# EAGLE design homegreen_node_basic v1.4.3 (EAGLE 9.6.2)
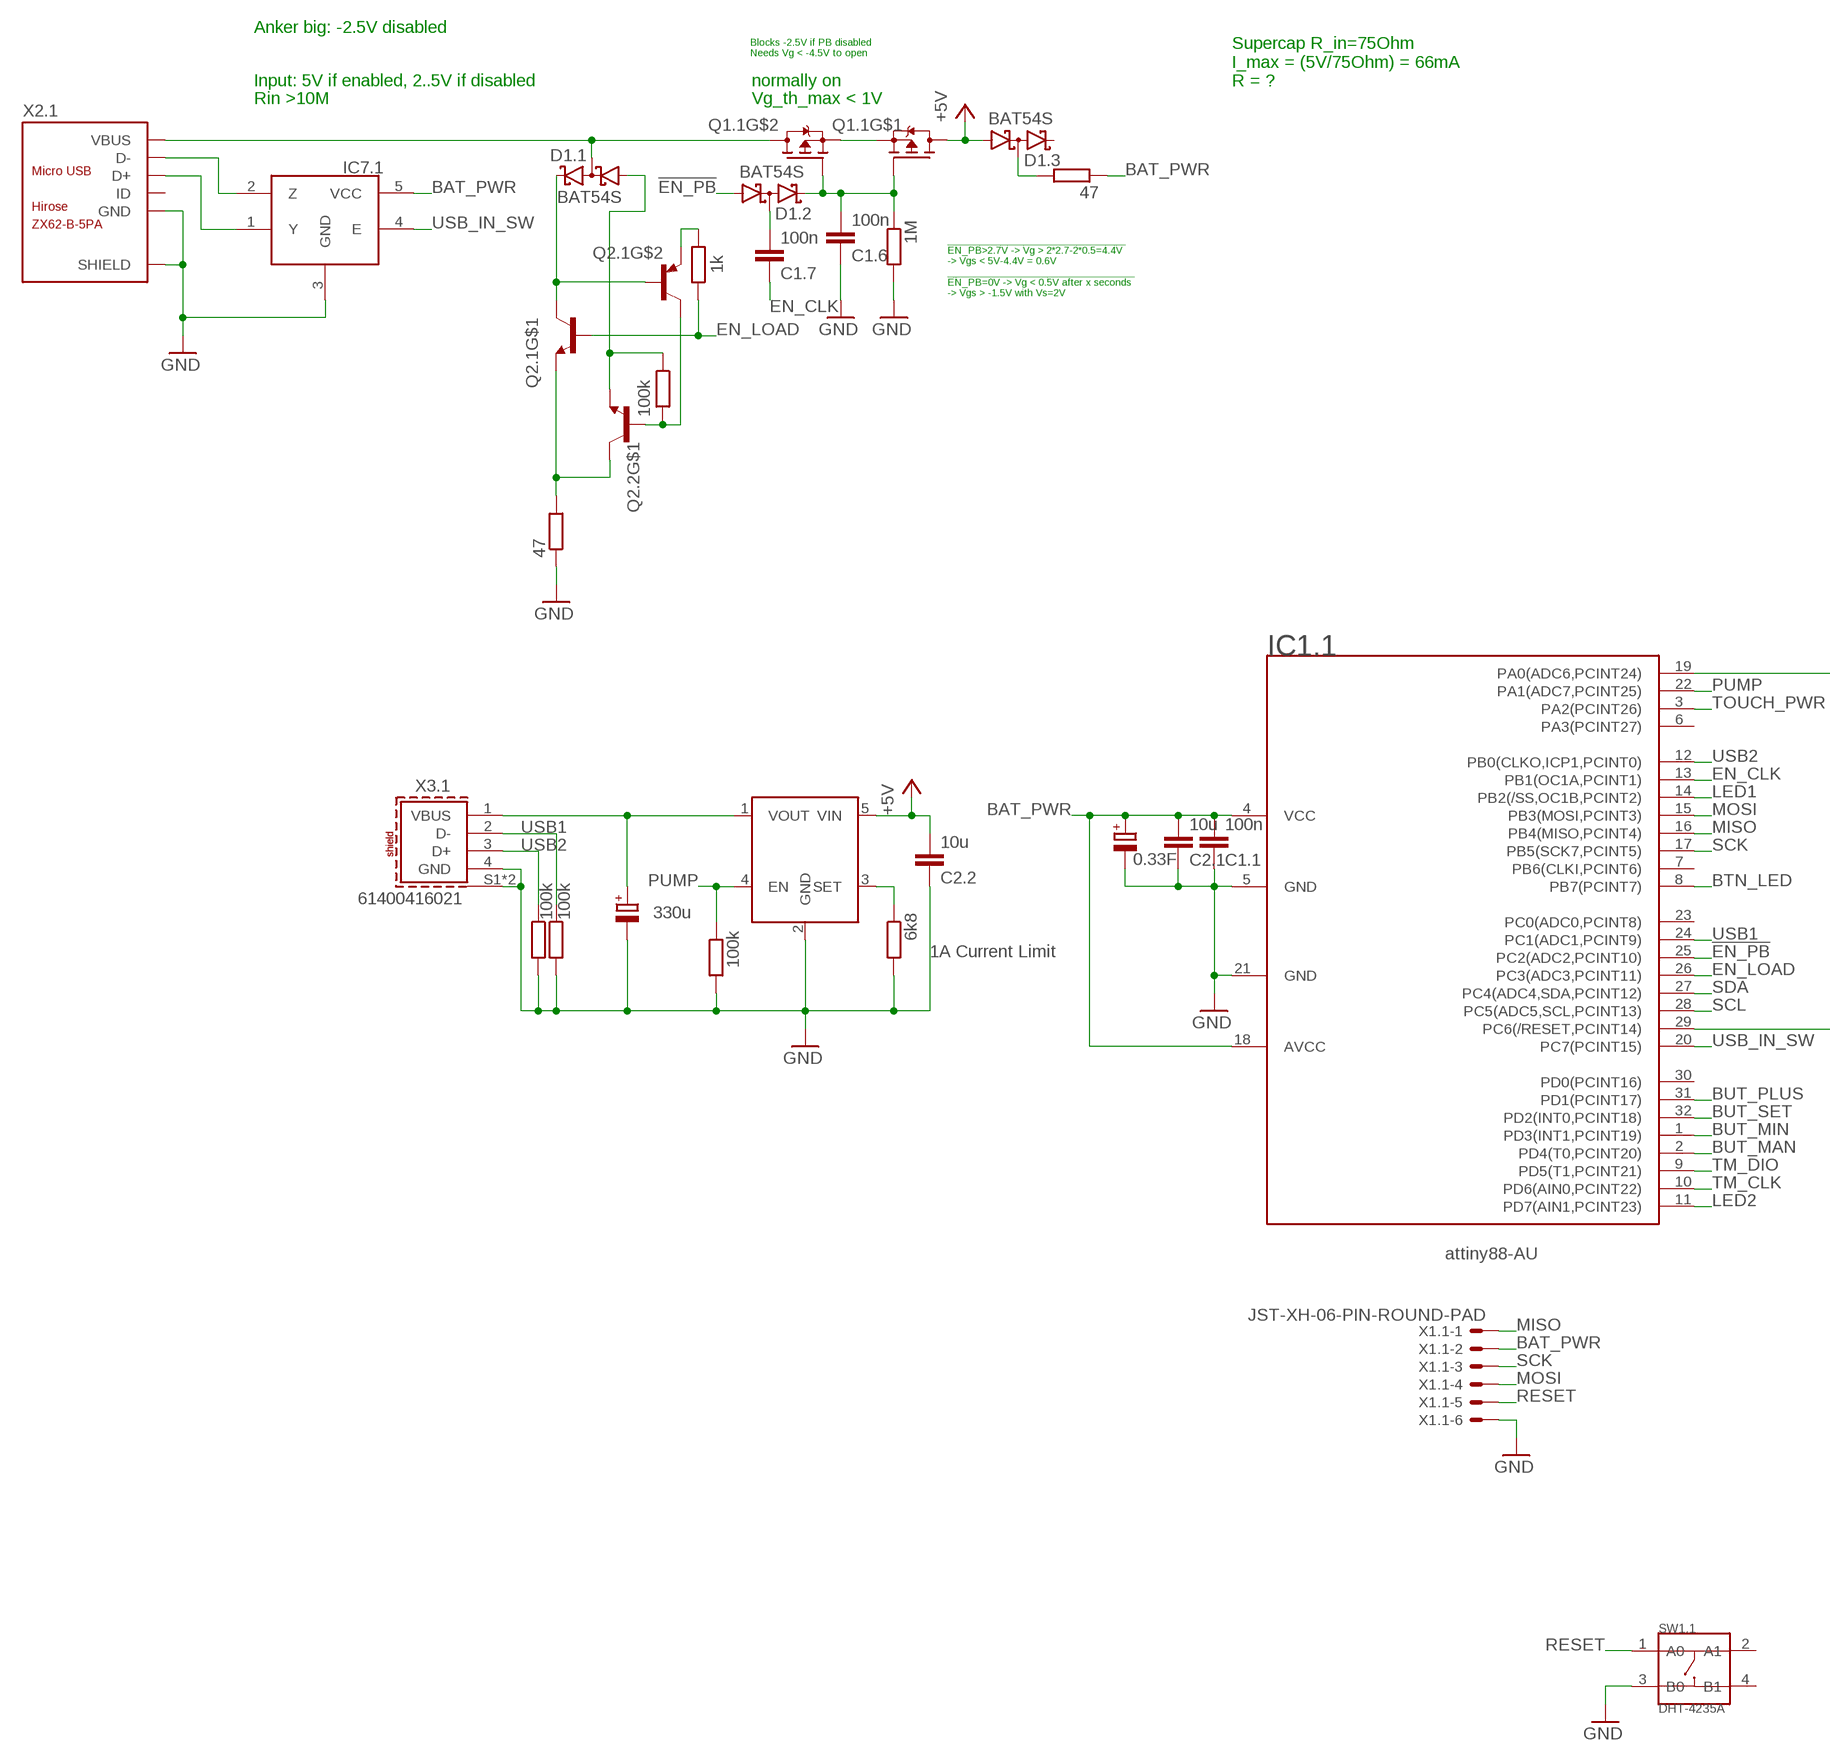
[diagram p0: schematic, sheet 1, part 1 of 2]
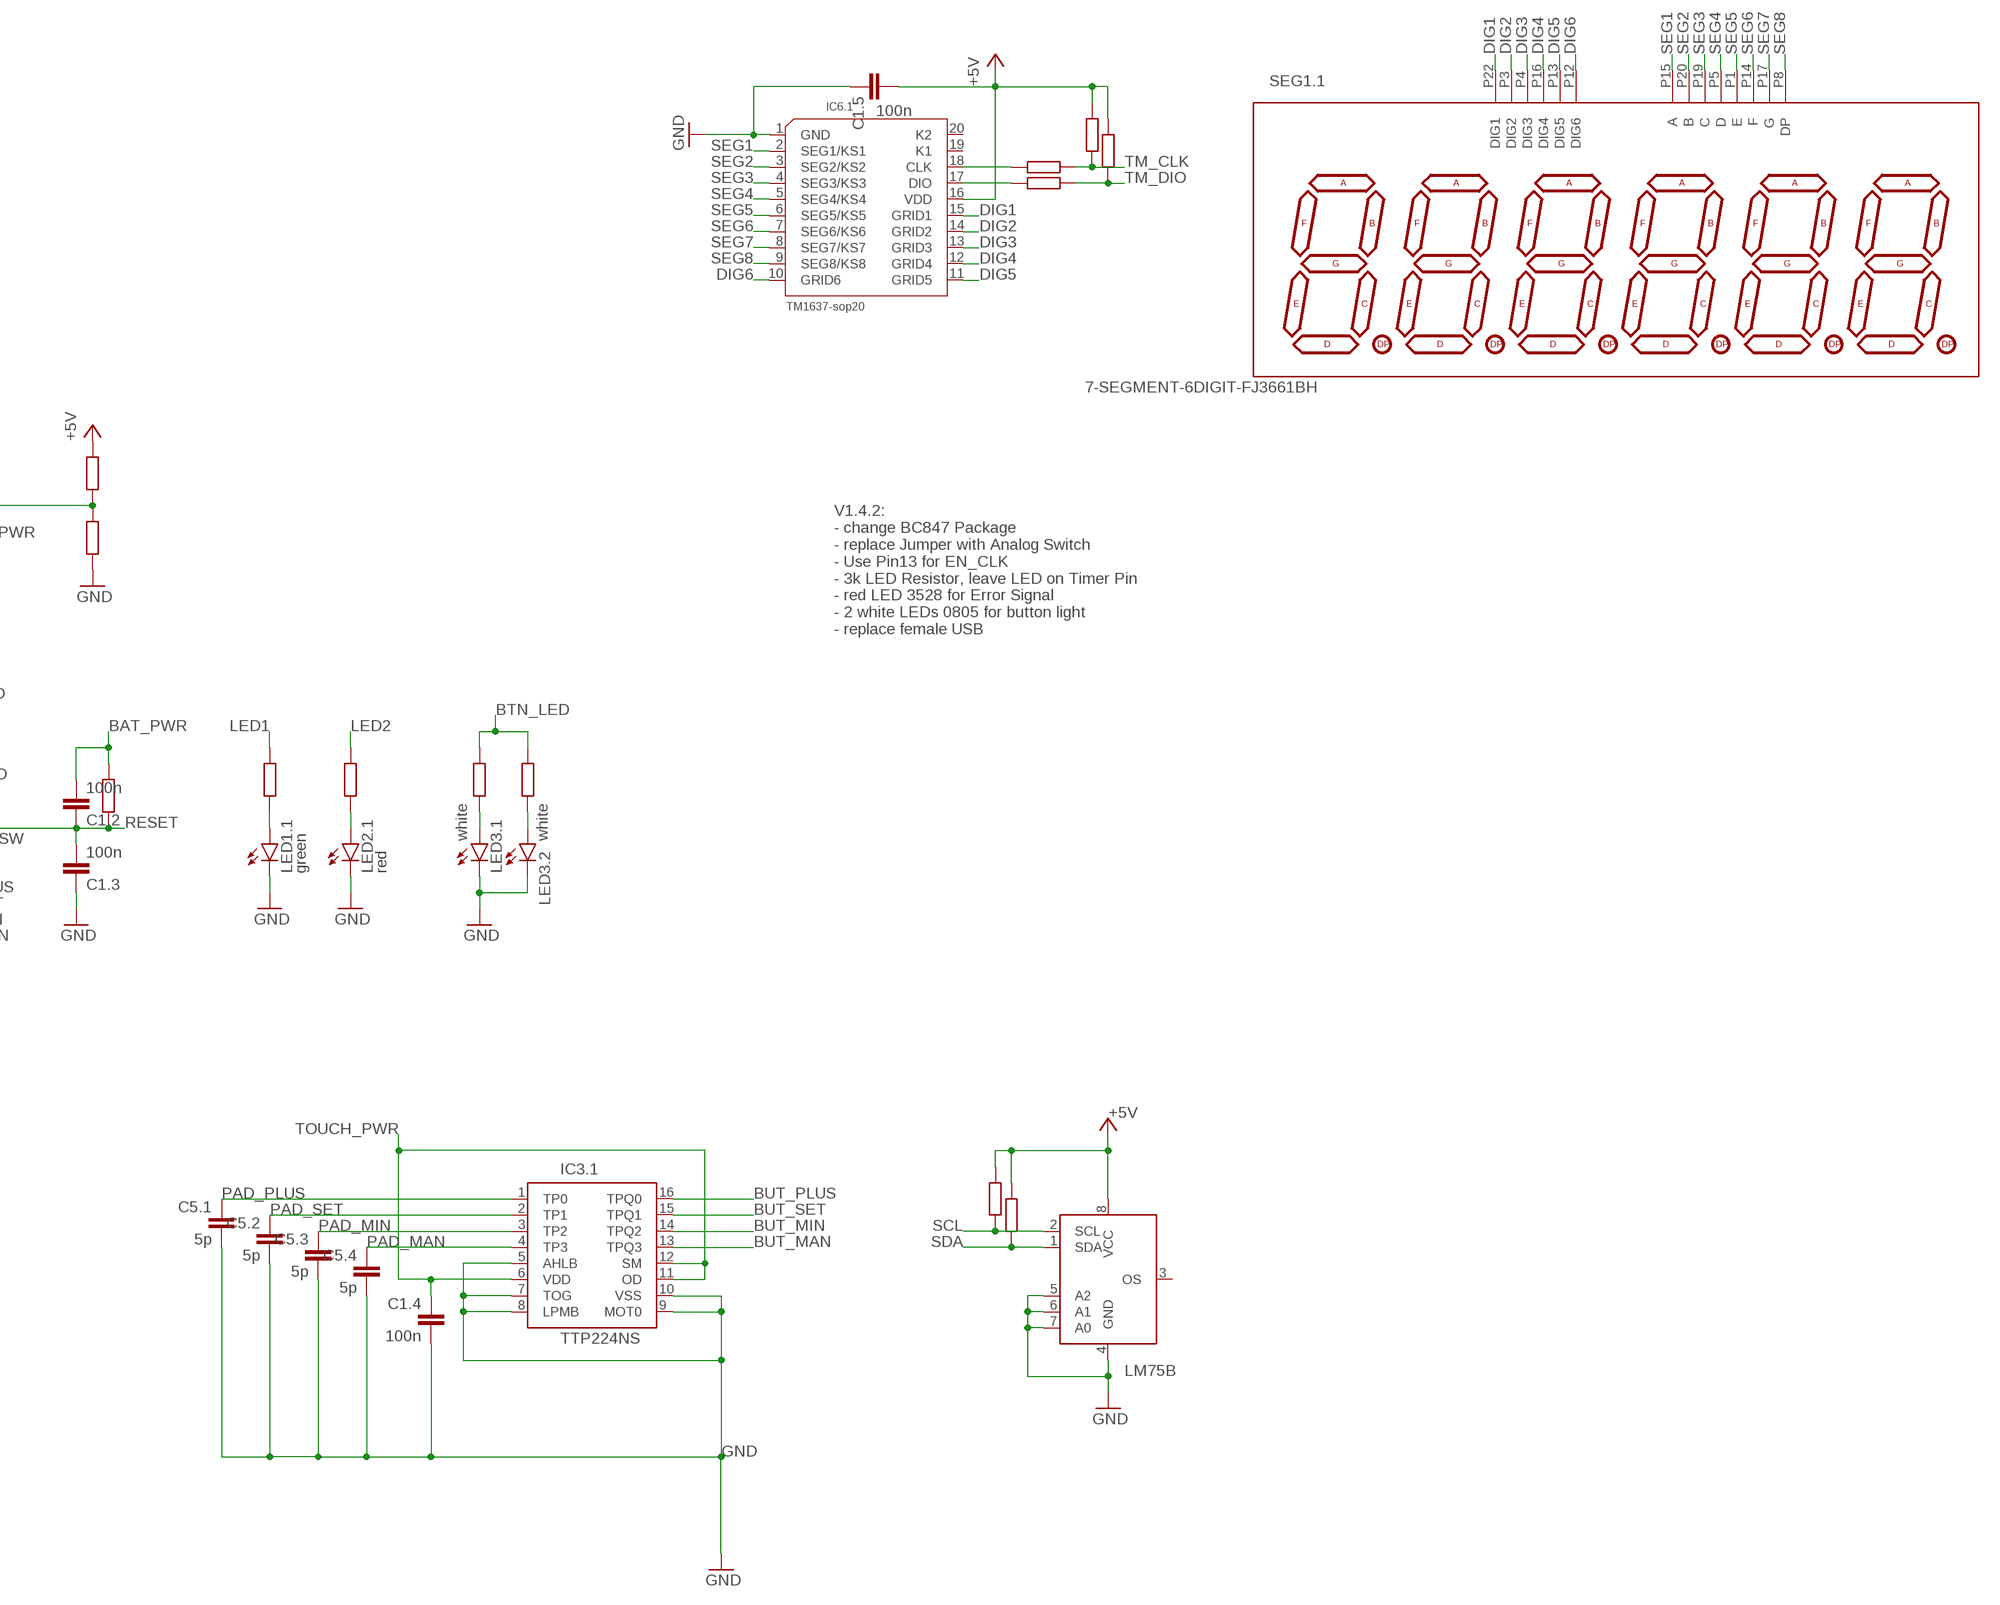
[diagram p1: schematic, sheet 1, part 2 of 2]

## Parts
C1.1  100n  C-EUC0805  [C0805]
C1.2  100n  C-EUC0805  [C0805]
C1.3  100n  C-EUC0805  [C0805]
C1.4  100n  C-EUC0805  [C0805]
C1.5  100n  C-EUC0805  [C0805]
C1.6  100n  C-EUC0805  [C0805]
C1.7  100n  C-EUC0805  [C0805]
C2.1  10u  C-EUC0805  [C0805]
C2.2  10u  C-EUC0805  [C0805]
C3.1  0.33F  SUPERCAP  [C_FYD0H104ZF]
C4.1  330u  CPOL-EUD  [PANASONIC_D]
C5.1  5p  C-EUC0805  [C0805]
C5.2  5p  C-EUC0805  [C0805]
C5.3  5p  C-EUC0805  [C0805]
C5.4  5p  C-EUC0805  [C0805]
D1.1  BAT54S  [SOT23]
D1.2  BAT54S  [SOT23]
D1.3  BAT54S  [SOT23]
IC1.1  attiny88-AU  ATTINY88  [TQFP32-08]
IC2.1  LM75B  [SO8]
IC3.1  TTP224NS  [SSOP16]
IC5.1  MT9700_WS4603  MT9700MT9700  [SOT23-5]
IC6.1  TM1637-sop20  DRIVER-TM1637(SOP20)  [SOP20-1.27-12.7X7.65MM]
IC7.1  74AHC1G66  [SOT65P212X110-5N]
LED1.1  green  LEDKA-3528ASYC  [KA-3528ASYC]
LED2.1  red  LEDKA-3528ASYC  [KA-3528ASYC]
LED3.1  white  LEDCHIPLED_0805  [CHIPLED_0805]
LED3.2  white  LEDCHIPLED_0805  [CHIPLED_0805]
Q1.1  WST2011  CJL2623SOT23-6  [SOT23-6]
Q2.1  BC817DPN  [SOT23-6]
Q2.2  BC817DPN  [SOT23-6]
R1.1  6k8  R-EU_R0805  [R0805]
R1.2  6k8  R-EU_R0805  [R0805]
R1.3  6k8  R-EU_R0805  [R0805]
R2.1  1k  R-EU_R0805  [R0805]
R2.2  1k  R-EU_R0805  [R0805]
R2.3  1k  R-EU_R0805  [R0805]
R2.4  1k  R-EU_R0805  [R0805]
R2.5  1k  R-EU_R0805  [R0805]
R3.1  47  R-EU_R0805  [R0805]
R3.2  47  R-EU_R0805  [R0805]
R4.1  3k  R-EU_R0805  [R0805]
R4.2  3k  R-EU_R0805  [R0805]
R5.1  100k  R-EU_R0805  [R0805]
R5.2  100k  R-EU_R0805  [R0805]
R5.3  100k  R-EU_R0805  [R0805]
R5.4  100k  R-EU_R0805  [R0805]
R5.5  100k  R-EU_R0805  [R0805]
R5.6  100k  R-EU_R0805  [R0805]
R5.7  100k  R-EU_R0805  [R0805]
R5.8  100k  R-EU_R0805  [R0805]
R5.9  100k  R-EU_R0805  [R0805]
R6.1  1M  R-EU_R0805  [R0805]
SEG1.1  7-SEGMENT-6DIGIT-FJ3661BH  [7SEG_6D_FJ3661BH]
SW1.1  DHT-4235A  SMD-BUTTON-TOP-DHT-4235A(4P-4.2X3.2MM)  [SW4-SMD-4.2X3.2X2.5MM]
X1.1  JST-XH-06-PIN-ROUND-PAD  [JST-XH-06-PACKAGE-ROUND-PAD]
X2.1  ZX62-B-5PA  MICRO-USB-SMD(ZX62-B-5PA)  [ZX62-B-5PA]
X3.1  61400416021  61400416021  [61400416021]

## Nets
!EN_PB: D1.2.1(A1) IC1.1.25(PC2(ADC2,PCINT10))
+5V: C1.5.2 C2.2.2 D1.3.1(A1) IC2.1.8(VCC) IC5.1.5(VIN) IC6.1.16(VDD) Q1.1.6(D) R1.1.2 R1.3.2 R5.3.1 R5.5.2 R5.6.2
BAT_PWR: C1.1.2 C1.2.2 C2.1.2 C3.1.+ IC1.1.4(VCC) IC1.1.18(AVCC) IC7.1.5(VCC) R3.2.1 R5.7.1 X1.1.2
BTN_LED: IC1.1.8(PB7(PCINT7)) R2.1.2 R2.5.2
BUT_MAN: IC1.1.2(PD4(T0,PCINT20)) IC3.1.13(TPQ3)
BUT_MIN: IC1.1.1(PD3(INT1,PCINT19)) IC3.1.14(TPQ2)
BUT_PLUS: IC1.1.31(PD1(PCINT17)) IC3.1.16(TPQ0)
BUT_SET: IC1.1.32(PD2(INT0,PCINT18)) IC3.1.15(TPQ1)
DIG1: IC6.1.15(GRID1) SEG1.1.P22(DIG1)
DIG2: IC6.1.14(GRID2) SEG1.1.P3(DIG2)
DIG3: IC6.1.13(GRID3) SEG1.1.P4(DIG3)
DIG4: IC6.1.12(GRID4) SEG1.1.P16(DIG4)
DIG5: IC6.1.11(GRID5) SEG1.1.P13(DIG5)
DIG6: IC6.1.10(GRID6) SEG1.1.P12(DIG6)
EN_CLK: C1.7.1 IC1.1.13(PB1(OC1A,PCINT1))
EN_LOAD: IC1.1.26(PC3(ADC3,PCINT11)) Q2.1.2(B) R2.4.1
GND: C1.1.1 C1.3.1 C1.4.2 C1.5.1 C1.6.1 C2.1.1 C2.2.1 C3.1.- C4.1.- C5.1.2 C5.2.2 C5.3.2 C5.4.2 IC1.1.5(GND) IC1.1.21(GND) IC2.1.4(GND) IC2.1.5(A2) IC2.1.6(A1) IC2.1.7(A0) IC3.1.5(AHLB) IC3.1.7(TOG) IC3.1.8(LPMB) IC3.1.9(MOT0) IC3.1.10(VSS) IC5.1.2(GND) IC6.1.1(GND) IC7.1.3(GND) LED1.1.C LED2.1.C LED3.1.C LED3.2.C R1.2.2 R3.1.1 R5.2.2 R5.4.2 R5.8.2 R5.9.2 R6.1.2 SW1.1.3(B0) X1.1.6 X2.1.5(GND) X2.1.P1(SHIELD) X2.1.P2(SHIELD) X2.1.P3(SHIELD) X2.1.P4(SHIELD) X2.1.P5(SHIELD) X2.1.P6(SHIELD) X3.1.4(GND) X3.1.S1(SHIELD) X3.1.S2(SHIELD)
LED1: IC1.1.14(PB2(/SS,OC1B,PCINT2)) R4.1.2
LED2: IC1.1.11(PD7(AIN1,PCINT23)) R4.2.2
MISO: IC1.1.16(PB4(MISO,PCINT4)) X1.1.1
MOSI: IC1.1.15(PB3(MOSI,PCINT3)) X1.1.4
N$1: IC6.1.18(CLK) R2.2.2
N$2: C4.1.+ IC5.1.1(VOUT) X3.1.1(VBUS)
N$3: Q1.1.2(S) Q1.1.5(S)
N$4: IC6.1.17(DIO) R2.3.2
N$5: D1.3.3(C1A2) R3.2.2
N$6: Q2.1.1(E) Q2.2.6(C) R3.1.2
N$7: LED1.1.A R4.1.1
N$8: IC1.1.19(PA0(ADC6,PCINT24)) R5.3.2 R5.4.1
N$9: C1.7.2 D1.2.3(C1A2)
N$10: Q2.1.4(E) R2.4.2
N$11: LED2.1.A R4.2.1
N$12: D1.1.2(C2) Q2.1.5(B) Q2.1.6(C)
N$13: IC5.1.3(SET) R1.2.1
N$14: D1.1.1(A1) Q2.2.1(E) R5.1.1
N$15: Q2.1.3(C) Q2.2.2(B) R5.1.2
N$16: LED3.1.A R2.1.1
N$17: C1.6.2 D1.2.2(C2) Q1.1.1(G) Q1.1.3(G) R6.1.1
N$18: LED3.2.A R2.5.1
N$20: IC7.1.1(Y) X2.1.3(D+)
N$21: IC7.1.2(Z) X2.1.2(D-)
PAD_MAN: C5.4.1 IC3.1.4(TP3)
PAD_MIN: C5.3.1 IC3.1.3(TP2)
PAD_PLUS: C5.1.1 IC3.1.1(TP0)
PAD_SET: C5.2.1 IC3.1.2(TP1)
PUMP: IC1.1.22(PA1(ADC7,PCINT25)) IC5.1.4(EN) R5.2.1
RESET: C1.2.1 C1.3.2 IC1.1.29(PC6(/RESET,PCINT14)) R5.7.2 SW1.1.1(A0) X1.1.5
SCK: IC1.1.17(PB5(SCK7,PCINT5)) X1.1.3
SCL: IC1.1.28(PC5(ADC5,SCL,PCINT13)) IC2.1.2(SCL) R1.3.1
SDA: IC1.1.27(PC4(ADC4,SDA,PCINT12)) IC2.1.1(SDA) R1.1.1
SEG1: IC6.1.2(SEG1/KS1) SEG1.1.P15(A)
SEG2: IC6.1.3(SEG2/KS2) SEG1.1.P20(B)
SEG3: IC6.1.4(SEG3/KS3) SEG1.1.P19(C)
SEG4: IC6.1.5(SEG4/KS4) SEG1.1.P5(D)
SEG5: IC6.1.6(SEG5/KS5) SEG1.1.P1(E)
SEG6: IC6.1.7(SEG6/KS6) SEG1.1.P14(F)
SEG7: IC6.1.8(SEG7/KS7) SEG1.1.P17(G)
SEG8: IC6.1.9(SEG8/KS8) SEG1.1.P8(DP)
TM_CLK: IC1.1.10(PD6(AIN0,PCINT22)) R2.2.1 R5.5.1
TM_DIO: IC1.1.9(PD5(T1,PCINT21)) R2.3.1 R5.6.1
TOUCH_PWR: C1.4.1 IC1.1.3(PA2(PCINT26)) IC3.1.6(VDD) IC3.1.11(OD) IC3.1.12(SM)
USB1: IC1.1.24(PC1(ADC1,PCINT9)) R5.9.1 X3.1.2(D-)
USB2: IC1.1.12(PB0(CLKO,ICP1,PCINT0)) R5.8.1 X3.1.3(D+)
USB_IN_SW: IC1.1.20(PC7(PCINT15)) IC7.1.4(E)
VBUS: D1.1.3(C1A2) Q1.1.4(D) X2.1.1(VBUS)
Unconnected: D1.3.2(C2) IC1.1.6(PA3(PCINT27)) IC1.1.7(PB6(CLKI,PCINT6)) IC1.1.23(PC0(ADC0,PCINT8)) IC1.1.30(PD0(PCINT16)) IC2.1.3(OS) IC6.1.19(K1) IC6.1.20(K2) Q2.2.3(C) Q2.2.4(E) Q2.2.5(B) SW1.1.2(A1) SW1.1.4(B1) X2.1.4(ID)

## Notes on the sheet
- Anker big: -2.5V disabled
- Blocks -2.5V if PB disabled
  Needs Vg < -4.5V to open
- Input: 5V if enabled, 2..5V if disabled | normally on
- Supercap R_in=75Ohm
  I_max = (5V/75Ohm) = 66mA
  R = ?
- Rin >10M | Vg_th_max < 1V
- !EN_PB>2.7V -> Vg > 2*2.7-2*0.5=4.4V 
  -> Vgs < 5V-4.4V = 0.6V
  
  !EN_PB=0V -> Vg < 0.5V after x seconds 
  -> Vgs > -1.5V with Vs=2V
- V1.4.2:
  - change BC847 Package
  - replace Jumper with Analog Switch
  - Use Pin13 for EN_CLK
  - 3k LED Resistor, leave LED on Timer Pin
  - red LED 3528 for Error Signal
  - 2 white LEDs 0805 for button light
  - replace female USB
- 1A Current Limit

## Library data of the parts
C1.1-C1.7 C2.1 C2.2 C5.1-C5.4 = rcl:C-EU: CAPACITOR, European symbol; SPICEPREFIX: C
C3.1 = philmalessa:SUPERCAP
C4.1 = rcl:CPOL-EU: POLARIZED CAPACITOR, European symbol; SPICEPREFIX: C
D1.1-D1.3 = diode:BAT54S: Schottky Diodes Pin connection corrected 2011-05-04 Source: Fairchild .. BAT54.pdf
IC1.1 = philmalessa:ATTINY88
IC2.1 = philmalessa:LM75B: Digital temperature sensor and thermal watchdog AAL Eindhoven MK
IC3.1 = philmalessa:TTP224N
IC5.1 = philmalessa:MT9700
IC6.1 = philmalessa:DRIVER-TM1637(SOP20): 310040027; MPN: TM1637
IC7.1 = philmalessa:74AHC1G66
LED1.1 LED2.1 LED3.1 LED3.2 = led:LED: LED OSRAM: - CHIPLED LG R971, LG N971, LY N971, LG Q971, LY Q971, LO R971, LY R971 LH N974, LH R974 LS Q976, LO Q976, LY Q976 LO Q996 - Hyper CHIPLED LW Q18S LB Q993, LB Q99A, LB R99A - SideLED LS A670, LO A670, LY A670, LG A670, LP A670 LB A673, LV A673, LT A673, LW A673 LH A674 LY A675 LS A676, LA A676, LO A676, LY A676, LW A676 LS A679, LY A679, LG A679 - Hyper Micro SIDELED® LS Y876, LA Y876, LO Y876, LY Y876 LT Y87S - SmartLED LW L88C, LW L88S LB L89C, LB L89S, LG L890 LS L89K, LO L89K, LY L89K LS L896, LA L896, LO L896, LY L896 - TOPLED LS T670, LO T670, LY T670, LG T670, LP T670 LSG T670, LSP T670, LSY T670, LOP T670, LYG T670 LG T671, LOG T671, LSG T671 LB T673, LV T673, LT T673, LW T673 LH T674 LS T676, LA T676, LO T676, LY T676, LB T676, LH T676, LSB T676, LW T676 LB T67C, LV T67C, LT T67C, LS T67K, LO T67K, LY T67K, LW E67C LS E67B, LA E67B, LO E67B, LY E67B, LB E67C, LV E67C, LT E67C LW T67C LS T679, LY T679, LG T679 LS T770, LO T770, LY T770, LG T770, LP T770 LB T773, LV T773, LT T773, LW T773 LH T774 LS E675, LA E675, LY E675, LS T675 LS T776, LA T776, LO T776, LY T776, LB T776 LHGB T686 LT T68C, LB T68C - Hyper Mini TOPLED® LB M676 - Mini TOPLED Santana® LG M470 LS M47K, LO M47K, LY M47K Source: http://www.osram.convergy.de LUXEON: - LUMILED® LXK2-PW12-R00, LXK2-PW12-S00, LXK2-PW14-U00, LXK2-PW14-V00 LXK2-PM12-R00, LXK2-PM12-S00, LXK2-PM14-U00 LXK2-PE12-Q00, LXK2-PE12-R00, LXK2-PE12-S00, LXK2-PE14-T00, LXK2-PE14-U00 LXK2-PB12-K00, LXK2-PB12-L00, LXK2-PB12-M00, LXK2-PB14-N00, LXK2-PB14-P00, LXK2-PB14-Q00 LXK2-PR12-L00, LXK2-PR12-M00, LXK2-PR14-Q00, LXK2-PR14-R00 LXK2-PD12-Q00, LXK2-PD12-R00, LXK2-PD12-S00 LXK2-PH12-R00, LXK2-PH12-S00 LXK2-PL12-P00, LXK2-PL12-Q00, LXK2-PL12-R00 Source: www.luxeon.com KINGBRIGHT: KA-3528ASYC Source: www.kingbright.com
Q1.1 = philmalessa:CJL2623
Q2.1 Q2.2 = philmalessa:BC817DPN
R1.1-R1.3 R2.1-R2.5 R3.1 R3.2 R4.1 R4.2 R5.1-R5.9 R6.1 = rcl:R-EU_: RESISTOR, European symbol; SPICEPREFIX: R
SEG1.1 = philmalessa:7-SEGMENT-6DIGIT-FJ3661BH: 2 Digit 7 Segment Display Datasheet: FJ3261BH <https://datasheet.lcsc.com/szlcsc/Made-in-China-FJ3261BH_C10698.pdf>
SW1.1 = philmalessa:SMD-BUTTON-TOP-DHT-4235A(4P-4.2X3.2MM): 311020045; MPN: DHT-4235A
X1.1 = philmalessa:JST-XH-06-PIN: JST XH Connector 2 Pin Wire to board connector. Pitch: 2,54 mm, (0.100") Number of pins: 6 Created by Rembrandt Electronics www.rembrandtelectronics.com
X2.1 = philmalessa:MICRO-USB-SMD(ZX62-B-5PA): 320010005; MPN: ZX62-B-5PA
X3.1 = Wurth_Connectors_WR-USB:61400416021: WR-COM USB 2.0 Type A Horizontal Kind Properties Durability:1 500 Mating cycles Quality Class:1 500 Mating cycles Connector Type:USB Gender:Receptacle Type:Horizontal General Information Operating Temperature:-40up to +105 °C Compliance:RoHS Electrical Properties IR 1:1.5 A Working Voltage:30V (AC) Withstanding Voltage:750 V (AC) Contact Resistance:20 mΩ Material Properties Insulator Material:PBT Insulator Flammability Rating:UL94 V-0 Color:White Cover Material:Brass Cover Plating:Nickel Contact Material:Copper Alloy Contact Plating:Selective Gold Contact Type:Stamped Shielding Material:Brass Shielding Plating:Nickel <https://www.we-online.com/catalog/media/o32983v209%20Family_WR-COM_61400416021.jpg> Details see: https://www.we-online.com/catalog/en/COM_TYPE_A_HORIZONTAL/ Updated by Yingchun, Shan 2020-01-14 2020 (C) Würth Elektronik; APPLICATION: USB 2.0; DATASHEET-URL: https://www.we-online.com/catalog/datasheet/61400416021.pdf; GERDER: Receptacle; INTERFACE-TYPE: Type A; IR1: 1.5A; MOUNT: THT; PACKAGING: Tray; PART-NUMBER: 61400416021; PINS: 4; TYPE: Horizontal; WORKING-VOLTAGE: 30V(AC)

## Board
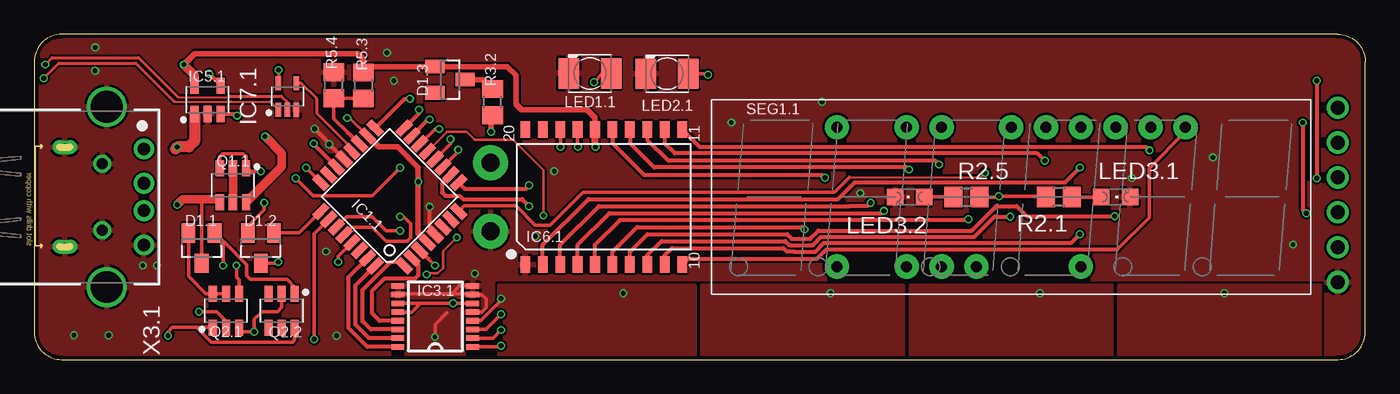
[diagram p2: board, top side]
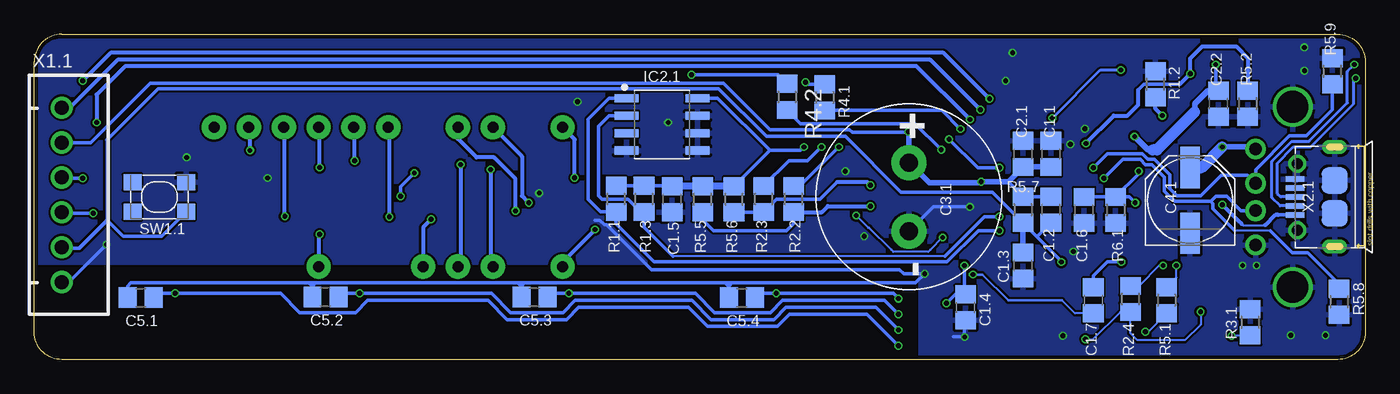
[diagram p3: board, bottom side, seen from below]

Size 97 x 23.7 mm. Coordinates in mm from the lower left corner, seen from the top.
Outline: 2,0 95,0 arc90 97,2 97,21.7 arc90 95,23.7 2,23.7 arc90 0,21.7 0,2 arc90 2,0
Copper layers (1*16): Top 0.035mm / dielectric 1.5mm / Bottom 0.035mm
Design rules "seeed_advanced_2layer *": minimum track width 4mil, minimum drill 0.2mm, track to track 6mil, track to pad 6mil, pad to pad 6mil, via to via 12mil, smd to smd 6mil, copper to edge 0.3mm, drill to drill 0.2mm, minimum pad ring 0.1mm, minimum via ring 0.1mm, stop-mask expansion 0.1mm, vias tented up to drill 0mil, thermal gap 0.2mm

### Footprints (pad centres in the part's own frame; a part is rotated, then mirrored left to right if it is on the bottom)
C0805 = smd 1.3 x 1.5: 1 -0.95,0; 2 0.95,0
C_FYD0H104ZF = drill 1.3 pad 2.54: + -2.5,0; - 2.5,0
PANASONIC_D = smd 3 x 1.4: + 2.4,0; - -2.4,0
SOT23 = smd 1 x 1.4: 1 -0.95,-1.1; 2 0.95,-1.1; 3 0,1.1
TQFP32-08 = smd 1.27 x 0.559: 1 -4.293,2.8; 2 -4.293,2; 3 -4.293,1.2; 4 -4.293,0.4; 5 -4.293,-0.4; 6 -4.293,-1.2; 7 -4.293,-2; 8 -4.293,-2.8; 17 4.293,-2.8; 18 4.293,-2; 19 4.293,-1.2; 20 4.293,-0.4; 21 4.293,0.4; 22 4.293,1.2; 23 4.293,2; 24 4.293,2.8 | smd 0.559 x 1.27: 9 -2.8,-4.293; 10 -2,-4.293; 11 -1.2,-4.293; 12 -0.4,-4.293; 13 0.4,-4.293; 14 1.2,-4.293; 15 2,-4.293; 16 2.8,-4.293; 25 2.8,4.293; 26 2,4.293; 27 1.2,4.293; 28 0.4,4.293; 29 -0.4,4.293; 30 -1.2,4.293; 31 -2,4.293; 32 -2.8,4.293
SO8 = smd 1.746 x 0.592: 1 -2.585,1.905; 2 -2.585,0.635; 3 -2.585,-0.635; 4 -2.585,-1.905; 5 2.585,-1.905; 6 2.585,-0.635; 7 2.585,0.635; 8 2.585,1.905
SSOP16 = smd 0.914 x 0.406: 1 -2.718,2.223; 2 -2.718,1.587; 3 -2.718,0.953; 4 -2.718,0.318; 5 -2.718,-0.318; 6 -2.718,-0.953; 7 -2.718,-1.587; 8 -2.718,-2.223; 9 2.718,-2.223; 10 2.718,-1.587; 11 2.718,-0.953; 12 2.718,-0.318; 13 2.718,0.318; 14 2.718,0.953; 15 2.718,1.587; 16 2.718,2.223
SOT23-5 = smd 1.18 x 0.589: 1 -1.024,0.95; 2 -1.024,0; 3 -1.024,-0.95; 4 1.024,-0.95; 5 1.024,0.95
SOP20-1.27-12.7X7.65MM = smd 0.7 x 1.2: 1 -5.715,-4.925; 2 -4.445,-4.925; 3 -3.175,-4.925; 4 -1.905,-4.925; 5 -0.635,-4.925; 6 0.635,-4.925; 7 1.905,-4.925; 8 3.175,-4.925; 9 4.445,-4.925; 10 5.715,-4.925; 11 5.715,4.925; 12 4.445,4.925; 13 3.175,4.925; 14 1.905,4.925; 15 0.635,4.925; 16 -0.635,4.925; 17 -1.905,4.925; 18 -3.175,4.925; 19 -4.445,4.925; 20 -5.715,4.925
SOT65P212X110-5N = smd 1.025 x 0.397: 1 -0.975,0.65; 2 -0.975,0; 3 -0.975,-0.65; 4 0.975,-0.65; 5 0.975,0.65
KA-3528ASYC = smd 1.5 x 2.2: A -1.55,0; C 1.55,0
CHIPLED_0805 = smd 1.2 x 1.2: A 0,-1.05; C 0,1.05
SOT23-6 = smd 1.171 x 0.589: 1 -1.25,0.95; 2 -1.25,0; 3 -1.25,-0.95; 4 1.25,-0.95; 5 1.25,0; 6 1.25,0.95
R0805 = smd 1.3 x 1.5: 1 -0.95,0; 2 0.95,0
7SEG_6D_FJ3661BH = drill 0.8 pad 1.778: P1 -12.7,-5.08; P3 -7.62,-5.08; P4 -5.08,-5.08; P5 -2.54,-5.08; P8 5.08,-5.08; P12 12.7,5.08; P13 10.16,5.08; P14 7.62,5.08; P15 5.08,5.08; P16 2.54,5.08; P17 0,5.08; P19 -5.08,5.08; P20 -7.62,5.08; P22 -12.7,5.08
SW4-SMD-4.2X3.2X2.5MM = smd 1.3 x 1.15: 1 -1.95,1.075; 2 1.95,1.075; 3 -1.95,-1.075; 4 1.95,-1.075
JST-XH-06-PACKAGE-ROUND-PAD = drill 1.016: 1 -6.35,0; 2 -3.81,0; 3 -1.27,0; 4 1.27,0; 5 3.81,0; 6 6.35,0
ZX62-B-5PA = smd 0.4 x 1.35: 1 -1.3,2.875; 2 -0.65,2.875; 3 0,2.875; 4 0.65,2.875; 5 1.3,2.875 | smd 1.9 x 1.9: P1 -1.2,0; P2 1.2,0 | drill 0.508 pad 1.016 long: P3 -3.625,0; P4 3.625,0 | drill 0.8: P5 -2.425,2.73; P6 2.425,2.73
61400416021 = drill 0.92: 1 -3.5,5.99; 2 -1,5.99; 3 1,5.99; 4 3.5,5.99 | drill 2.3: S1 -6.57,3.28; S2 6.57,3.28

### Placement (x,y rotation side)
C1.1  22.91,14.99 270 bottom
C1.2  22.91,10.92 90 bottom
C1.3  24.94,6.86 90 bottom
C1.4  29.13,3.81 270 bottom
C1.5  50.51,11.68 90 bottom
C1.6  20.5,10.9 90 bottom
C1.7  19.81,4.32 90 bottom
C2.1  24.94,14.99 270 bottom
C2.2  10.7,18.65 90 bottom
C3.1  33.25,11.85 270 bottom
C4.1  12.76,11.6 90 bottom
C5.1  89.24,4.51 180 bottom
C5.2  75.78,4.56 180 bottom
C5.3  60.54,4.55 180 bottom
C5.4  45.43,4.51 180 bottom
D1.1  12.19,8.13 180 top
D1.2  16.51,8.13 180 top
D1.3  30.3,20.4 270 top
IC1.1  25.9,11.85 135 top
IC2.1  51.26,17.14 0 bottom
IC3.1  29.23,3.15 180 top
IC5.1  12.62,18.92 90 top
IC6.1  41.5,11.85 0 top
IC7.1  18.45,19.16 90 top
LED1.1  40.49,20.85 180 top
LED2.1  46.12,20.83 180 top
LED3.1  78.8,11.85 270 top
LED3.2  63.8,11.85 90 top
Q1.1  14.48,12.7 270 top
Q2.1  13.97,3.56 90 top
Q2.2  18.03,3.56 270 top
R1.1  54.59,11.71 90 bottom
R1.2  15.29,20.07 90 bottom
R1.3  52.56,11.71 90 bottom
R2.1  74.67,11.84 180 top
R2.2  41.66,11.7 90 bottom
R2.3  43.84,11.7 90 bottom
R2.4  17.1,4.42 90 bottom
R2.5  67.93,11.84 0 top
R3.1  8.38,2.72 270 bottom
R3.2  33.4,18.76 90 top
R4.1  39.4,19.1 270 bottom
R4.2  42.14,19.14 270 bottom
R5.1  14.48,4.32 270 bottom
R5.2  8.56,18.65 270 bottom
R5.3  23.98,19.97 270 top
R5.4  21.82,19.99 90 top
R5.5  48.29,11.68 90 bottom
R5.6  46.01,11.68 90 bottom
R5.7  24.94,10.92 270 bottom
R5.8  1.9,4.22 270 bottom
R5.9  2.39,21 90 bottom
R6.1  18.2,10.9 270 bottom
SEG1.1  71.2,11.85 0 top
SW1.1  87.88,11.85 180 bottom
X1.1  95,12 270 bottom
X2.1  2.23,11.85 90 bottom
X3.1  2,11.85 270 top

### Tracks (layer width: path | path; a pad name or v marks a point on that pad's centre or on a via)
!EN_PB
  Top 0.254: IC1.1.25 19.32,9.23 D1.2.1
+5V  (via drill 0.35)
  Top 0.406: v10.9,21.5 11.7,22.3 23.6,22.3 23.98,21.92 R5.3.1 24.41,21.35 D1.3.1 34.47,21.35 35.1,20.72 35.1,18.6 35.5,18.2 40.3,18.2 40.87,17.64 IC6.1.16
  Top 0.508: v40.89,15.49 40.87,15.52 IC6.1.16
  Top 0.61: v16.81,16.26 18.03,15.03 18.03,14.06 Q1.1.6 | IC5.1.5 11.67,20.73 v10.9,21.5
  Bottom 0.254: v40.89,15.49 41.15,15.24 43.4,15.24 | 43.4,15.24 R5.6.2 | C2.2.2 10.9,19.8 v10.9,21.5 | R1.1.2 R1.3.2 50.54,12.66 C1.5.2 | IC2.1.8 47.2,19.04 43.4,15.24
  Bottom 0.406: 15.49,15.29 15.84,15.29 v16.81,16.26 | C2.2.2 11.47,19.6 12.43,18.64 12.43,18.04
  Bottom 0.508: 40.89,15.46 v40.89,15.49 | R5.6.2 R5.5.2 C1.5.2
  Bottom 0.813: 12.43,18.04 15.19,15.29 15.49,15.29
BAT_PWR  (via drill 0.35)
  Top 0.203: IC1.1.18 22.98,17.6 v22.8,17.6 | v17.8,21.1 IC7.1.5
  Top 0.406: IC1.1.18 25.08,15.49 26.46,15.49 27.99,13.97 v27.99,12.95 27.99,9.2 IC1.1.4 | v33.3,16.6 33.3,17.71 R3.2.1
  Bottom 0.203: v22.8,17.6 19.3,21.1 v17.8,21.1
  Bottom 0.254: C1.2.2 R5.7.1 26.02,12.95 | 33.25,16.55 33.35,16.55 37.38,16.55 37.59,16.76 43.4,16.76 46.78,20.15 88.14,20.15 88.31,20.15 88.56,20.15 92.9,15.81 X1.1.2
  Bottom 0.406: C1.1.2 C2.1.2 26.02,12.95 v27.99,12.95 28.05,12.89 31.75,12.89 C3.1.+ 33.25,16.55 | 22.88,11.9 C1.2.2 | 33.35,16.55 v33.31,16.6 v33.3,16.6
BTN_LED  (via drill 0.35)
  Top 0.152: 59.4,13.3 69,13.3 v69.3,13.6
  Top 0.254: IC1.1.8 31.32,11.2 35.1,11.2 36.5,9.8 37.6,9.8 40,12.2 58.3,12.2 59.4,13.3 | R2.5.2 70.24,11.84 v70.3,11.9 73.66,11.9 R2.1.2
  Bottom 0.254: v69.3,13.6 70.3,12.6 v70.3,11.9
BUT_MAN
  Top 0.305: IC3.1.13 25.16,2.83 24.63,3.36 24.63,5.02 25.48,5.88 27.72,5.88 27.99,6.14 27.99,6.93 IC1.1.2
BUT_MIN
  Top 0.305: IC3.1.14 24.52,2.2 23.92,2.79 23.92,5.08 25.96,7.11 26.68,7.11 IC1.1.1
BUT_PLUS
  Top 0.305: IC3.1.16 24.27,0.93 22.91,2.29 22.91,6.03 IC1.1.31
BUT_SET
  Top 0.305: IC3.1.15 24.39,1.56 23.42,2.54 23.42,5.41 IC1.1.32
DIG1  (via drill 0.35)
  Top 0.305: IC6.1.15 42.13,15.78 44.47,13.45 57.42,13.45 v57.62,13.25
  Bottom 0.305: v57.62,13.25 57.62,16.05 SEG1.1.P22
DIG2  (via drill 0.35)
  Top 0.305: IC6.1.14 43.41,15.78 45.17,14.01 63.6,14.01 v63.75,13.85
  Bottom 0.305: SEG1.1.P3 63.75,6.94 v63.75,13.85
DIG3  (via drill 0.35)
  Top 0.305: IC6.1.13 44.67,16.03 46.24,14.47 65.69,14.47 v65.94,14.22
  Bottom 0.305: v65.94,14.22 65.94,6.95 SEG1.1.P4
DIG4  (via drill 0.35)
  Top 0.305: IC6.1.12 45.95,15.78 46.69,15.03 73.11,15.03 v73.66,14.48
  Bottom 0.305: v73.66,14.48 73.66,16.85 SEG1.1.P16
DIG5  (via drill 0.35)
  Top 0.305: IC6.1.11 48.5,15.49 81.03,15.49 v81.28,15.24
  Bottom 0.305: v81.28,15.24 81.28,16.85 SEG1.1.P13
DIG6
  Top 0.254: 78.93,8.03 81.26,10.35 81.26,13.95 83.9,16.59 SEG1.1.P12
  Top 0.305: IC6.1.10 47.66,7.37 57.06,7.37 57.72,8.03 78.93,8.03
EN_CLK  (via drill 0.35)
  Top 0.2: IC1.1.13 30.08,16.6 31.5,16.6 32.1,16 34.9,16 37.1,13.8 v37.1,10.5 | v30.8,8.9 29.79,7.88 29.79,6.66 29.41,6.28 28.68,6.28 v28.6,6.2
  Bottom 0.152: C1.7.1 21.15,3.37 22.1,4.32 | 31.7,8 31.85,7.85 34.4,7.85 34.54,8
  Bottom 0.2: v37.1,10.5 36.22,9.62 36.16,9.62 34.54,8 | v28.6,6.2 27.9,6.2 26.02,4.32 22.1,4.32 | v30.8,8.9 31.7,8
EN_LOAD  (via drill 0.35)
  Top 0.254: IC1.1.26 20.4,9.17 v20.4,1.48 | v12,3.48 13.28,3.48 13.97,2.79 Q2.1.2
  Bottom 0.152: v12,3.48 12,2.56 13.13,1.42 16.59,1.42 17.1,1.93 R2.4.1 17.85,3.47 19.84,1.48 v20.4,1.48
GND  (via drill 0.35)
  Top 0.254: IC3.1.10 26.57,4.8 30.43,4.8 | 30.43,4.8 31.88,4.8 IC3.1.7 32.59,4.74 32.91,4.42 32.91,3.78 32.59,3.47 IC3.1.5 31.88,3.4 | IC3.1.8 31,5.37 30.43,4.8 | 30.06,3.4 29.19,2.54 v29.19,1.65 | IC1.1.5 28.8,9.51 v28.8,11.12
  Top 0.305: IC1.1.21 v21.49,15.7 21.49,15.75 v20.42,16.82
  Bottom 0.254: 77.01,5.59 89.96,5.59 90.19,5.36 C5.1.2 | 77.01,5.59 76.5,5.59 | 76.5,5.59 61.77,5.59 | 61.77,5.59 61.52,5.59 | 61.52,5.59 61.26,5.59 | 61.26,5.59 46.66,5.59 | 46.66,5.59 46.4,5.59 | 46.4,5.59 46.15,5.59 | 90.19,5.31 C5.1.2 | C5.1.2 90.19,4.8 | 46.15,5.59 46.38,5.36 | 46.38,5.31 46.66,5.59 | 61.49,5.36 61.26,5.59 | 61.49,5.31 61.77,5.59 | 76.73,5.36 76.5,5.59 | 77.01,5.59 76.73,5.31 C5.2.2 | 90.19,5.06 C5.1.2 | 61.52,5.59 61.52,4.57 C5.3.2 | 46.4,5.59 46.4,4.54 C5.4.2 | 30.02,1.65 v29.19,1.65 29.19,2.8 C1.4.2 | 56.13,10.16 55.79,10.16 55.46,9.83 55.29,9.83 52.02,6.55 33.93,6.55 33.63,6.25 v32.11,6.25 32.77,5.59 46.15,5.59 | v28.8,11.12 31.48,11.12 C3.1.- | v91.74,8.38 94.47,5.65 X1.1.6
  other vias: 4.43,21.04 22.04,1.73 2.89,1.78 5.43,1.78 4.44,22.74 36.51,8.99 7.92,6.86 8.94,6.86 21.28,7.87 25.7,22.35 37.89,13.72 85.9,14.73 50.8,17.27 57.4,18.8 26.21,20.32 80,13.23 60.2,12.13
  pour Bottom (rank 3): 2,23.7 95,23.7 arc-90 97,21.7 97,3 arc-90 94,0 2,0 arc-90 0,2 0,21.7 arc-90
  pour Top (rank 3): 2,23.7 95,23.7 arc-90 97,21.7 97,2 arc-90 95,0 2,0 arc-90 0,2 0,21.7 arc-90
LED1  (via drill 0.35)
  Top 0.254: v29.5,16.8 29.2,16.8 28.13,15.73 IC1.1.14
  Bottom 0.254: R4.1.2 30.85,18.15 v29.5,16.8
LED2  (via drill 0.35)
  Top 0.254: IC1.1.11 30.9,15.15 v30.9,15.3
  Bottom 0.254: v30.9,15.3 32.8,17.2 41.15,17.2 R4.2.2
MISO  (via drill 0.35)
  Top 0.305: v28.05,18.2 28.05,17.96 IC1.1.16
  Bottom 0.305: v28.05,18.2 31.7,21.84 90.93,21.84 94.43,18.35 X1.1.1
MOSI  (via drill 0.35)
  Top 0.305: v28.82,17.5 28.72,17.5 IC1.1.15 | v92.46,17.27 92.46,10.92 v92.71,10.67
  Bottom 0.254: X1.1.4 94.94,10.67 v92.71,10.67
  Bottom 0.305: v28.82,17.5 32.71,21.39 90.37,21.39 92.46,19.3 v92.46,17.27
N$1  (via drill 0.35)
  Top 0.254: v38.35,15.49 38.35,16.75 IC6.1.18
  Bottom 0.254: 41.91,12.9 R2.2.2 41.2,12.65 v38.35,15.49
N$2  (via drill 0.35)
  Top 0.813: IC5.1.1 11.67,15.91 11.26,15.49 v10.41,15.49 10.27,15.35
  Bottom 0.406: X3.1.1 8.13,15.49 v10.41,15.49
  Bottom 0.813: C4.1.+ 11.91,14 v10.41,15.49
N$3
  Top 0.61: Q1.1.2 Q1.1.5
N$4  (via drill 0.35)
  Top 0.254: v39.62,15.49 39.59,15.52 IC6.1.17
  Bottom 0.254: v39.62,15.49 40.64,14.48 42.01,14.48 R2.3.2
N$5
  Top 0.406: D1.3.3 32.71,20.4 R3.2.2
N$6  (via drill 0.35)
  Top 0.254: v9.74,1.73 9.74,2.03 10.06,2.35 11.83,2.35 | 11.83,2.35 12.91,1.27 18.82,1.27 18.98,1.43 Q2.2.6 | 11.83,2.35 12.98,2.35 Q2.1.1
  Bottom 0.152: v9.74,1.73 9.71,1.77 R3.1.2
N$7  (via drill 0.35)
  Top 0.254: LED1.1.A 41.43,20.85 v40.79,20.21
  Bottom 0.254: R4.1.1 40.63,20.05 v40.79,20.21
N$8
  Top 0.254: 22.86,16.51 21.82,17.55 R5.4.1 23.96,19.04 R5.3.2
  Top 0.305: 22.86,16.51 23.64,15.73 IC1.1.19
N$9  (via drill 0.35)
  Top 0.254: v17.78,7.11 17.7,7.03 D1.2.3
  Bottom 0.254: C1.7.2 19.81,6.1 18.8,7.11 v17.78,7.11
N$10  (via drill 0.35)
  Top 0.254: v14.73,6.86 14.73,6.01 14.92,5.82 Q2.1.4
  Bottom 0.152: v14.73,6.86 14.99,6.86 16.48,5.37 R2.4.2
N$11  (via drill 0.35)
  Top 0.254: v49.1,20.76 49.03,20.83 LED2.1.A
  Bottom 0.254: R4.2.1 42.81,20.76 v49.1,20.76
N$12
  Top 0.254: Q2.1.5 Q2.1.6 12.49,4.81 11.24,6.06 D1.1.2
N$13  (via drill 0.35)
  Top 0.305: IC5.1.3 14.66,17.9 v14.78,17.78
  Bottom 0.305: v14.78,17.78 15.29,18.29 R1.2.1
N$14  (via drill 0.35)
  Top 0.254: v13.76,6.86 13.76,8.61 | 13.76,8.61 13.82,8.55 13.86,8.55 15.49,6.91 15.49,6.1 15.75,5.84 18.42,5.84 18.98,5.28 Q2.2.1 | 13.76,8.61 D1.1.1
  Bottom 0.152: R5.1.1 13.76,5.99 v13.76,6.86
N$15  (via drill 0.35)
  Top 0.254: Q2.2.2 18.03,3.81 17.72,3.5 16.59,3.5 16.02,2.93 v16.02,2.03 15.19,2.03 Q2.1.3
  Bottom 0.152: v16.02,2.03 15.81,2.03 R5.1.2
N$16
  Top 0.254: R2.1.1 77.74,11.84 LED3.1.A
N$17  (via drill 0.35)
  Top 0.254: Q1.1.3 13.53,14.8 13.72,14.99 15.24,14.99 15.43,14.8 Q1.1.1 15.66,13.72 v16.51,13.72 | v16.76,11.43 16.76,10.92 15.56,9.72 D1.2.2
  Bottom 0.254: C1.6.2 R6.1.1 | R6.1.1 16.51,13.54 v16.51,13.72 | R6.1.1 17.18,11.85 v16.76,11.43
N$18
  Top 0.254: LED3.2.A 66.97,11.85 R2.5.1
N$20  (via drill 0.35)
  Top 0.152: 17.19,18.8 14.32,18.8 10.2,18.8
  Top 0.203: v0.7,20.5 1.8,21.6 7.4,21.6 10.2,18.8 | 17.19,18.8 IC7.1.1
  Bottom 0.203: X2.1.3 6.15,11.85 6.4,12.1 6.4,14.32 5.22,15.49 3.97,15.49 0.84,18.62 0.84,20.35 v0.7,20.5
N$21  (via drill 0.35)
  Top 0.152: 10.44,19.16 10.5,19.1 14.19,19.1 14.29,19.2
  Top 0.203: v0.8,21.5 1.3,22 7.6,22 10.44,19.16 | IC7.1.2 18.45,18.75 18,19.2 14.29,19.2
  Bottom 0.203: X2.1.2 6.2,11.2 6.8,11.8 6.8,14.45 5.35,15.9 4.1,15.9 1.3,18.7 1.3,21 v0.8,21.5
PAD_MAN  (via drill 0.35)
  Top 0.254: IC3.1.4 32.53,2.83 34.02,4.32 v34.02,4.45
  Bottom 0.254: C5.4.1 44.16,4.83 v42.93,4.83 34.4,4.83 v34.02,4.45
  pour Top: 33.9,5.43 48.1,5.43 48.1,0 33.9,0
PAD_MIN  (via drill 0.35)
  Top 0.254: IC3.1.3 32.91,2.2 v34.02,3.3
  Bottom 0.254: 58.06,4.81 v58.04,4.83 | C5.3.1 59.32,4.83 v58.04,4.83 | v58.04,4.83 48.82,4.83 47.42,3.43 43.35,3.43 42.47,4.32 35.04,4.32 v34.02,3.3
  pour Top: 48.7,5.43 63.3,5.43 63.3,0 48.7,0
PAD_PLUS  (via drill 0.35)
  Top 0.254: IC3.1.1 33.93,0.93 v34.02,1.01
  Bottom 0.254: C5.1.1 87.98,4.83 v86.74,4.83 79.04,4.83 77.64,3.43 73.58,3.43 72.69,4.32 63.93,4.32 62.53,2.92 58.21,2.92 57.33,3.81 49.32,3.81 47.93,2.41 42.85,2.41 41.96,3.3 36.31,3.3 v34.02,1.01
  pour Top: 79.1,5.43 93.7,5.43 93.7,0 79.1,0
PAD_SET  (via drill 0.35)
  Top 0.254: IC3.1.2 33.42,1.56 v34.02,2.16
  Bottom 0.254: C5.2.1 74.56,4.83 v73.28,4.83 63.67,4.83 62.28,3.43 58.47,3.43 57.58,4.32 49.07,4.32 47.67,2.92 43.1,2.92 42.21,3.81 35.67,3.81 v34.02,2.16
  pour Top: 63.9,5.43 78.5,5.43 78.5,0 63.9,0
PUMP  (via drill 0.35)
  Top 0.305: IC1.1.22 20.37,15.69 v20.37,15.75 | v12.75,20.83 13.57,20 IC5.1.4
  Bottom 0.254: 16.56,19.64 16.13,20.07 13.51,20.07
  Bottom 0.305: v20.37,15.75 18.34,17.78 17.32,17.78 16.56,18.54 16.56,19.64 | 13.51,20.07 v12.75,20.83 12.75,21.95 11.89,22.81 9.4,22.81 8.56,21.97 R5.2.1
RESET  (via drill 0.35)
  Top 0.254: IC1.1.29 22.15,7.53 v22.15,7.11
  Bottom 0.254: 23.92,8.96 22.15,7.18 v22.15,7.11 | 23.92,8.96 R5.7.2 27.16,12.19 33.83,12.19 37.89,16.26 43.65,16.26 47.14,19.74 87.96,19.74 91.69,16 | 23.92,8.96 C1.2.1 22.78,9.97 | SW1.1.1 87.71,9 90.53,9 91.69,10.16 | X1.1.5 94.94,8.13 93.73,8.13
  Bottom 0.305: 91.69,16 91.69,10.16 93.73,8.13
  Bottom 0.406: R5.7.2 C1.3.2
SCK  (via drill 0.35)
  Top 0.305: v27.38,19 26.98,19 IC1.1.17 | v93.47,20.32 v93.47,13.21
  Bottom 0.254: X1.1.3 94.94,13.21 v93.47,13.21
  Bottom 0.305: v27.38,19 30.73,22.35 91.44,22.35 v93.47,20.32
SCL  (via drill 0.35)
  Top 0.254: v26.67,10.41 26.92,10.41 27.43,9.91 27.43,8.89 27.18,8.64 25.65,8.64 24.64,9.65 23.14,9.65 IC1.1.28
  Bottom 0.152: 30.65,7.52 50.44,7.52
  Bottom 0.254: IC2.1.2 55.13,17.77 55.88,17.02 55.88,11.94 55.63,11.68 55.46,11.68 55.46,11.69 53.73,11.69 52.8,10.76 R1.3.1 52.56,9.63 50.44,7.52 | v26.67,10.41 27.75,10.41 30.65,7.52
SDA  (via drill 0.35)
  Top 0.254: IC1.1.27 22.77,10.41 24.64,10.41 25.65,9.4 v26.67,9.4
  Bottom 0.254: IC2.1.1 55.13,19.04 56.64,17.53 56.64,11.68 55.71,10.76 R1.1.1 54.59,9.89 51.82,7.11 30.48,7.11 28.19,9.4 v26.67,9.4
SEG1  (via drill 0.35)
  Top 0.305: IC6.1.2 37.05,8.35 40.39,11.68 58.58,11.68 59.79,12.89 75.1,12.89 v76.2,13.99
  Bottom 0.305: v76.2,13.99 76.2,16.85 SEG1.1.P15
SEG2  (via drill 0.35)
  Top 0.305: IC6.1.3 38.33,8.35 41.15,11.18 59.44,11.18 60.71,11.18 v60.96,11.43
  Bottom 0.305: v60.96,11.43 61.46,11.93 61.46,14.81 SEG1.1.P20
SEG3  (via drill 0.35)
  Top 0.305: IC6.1.4 39.59,8.35 41.91,10.67 61.77,10.67 v61.93,10.83
  Bottom 0.305: v61.93,10.83 61.93,13.16 63.5,14.73 64.77,14.73 66.12,16.08 SEG1.1.P19
SEG4  (via drill 0.35)
  Top 0.305: IC6.1.5 40.87,8.35 42.67,10.16 68.02,10.16 v68.08,10.22
  Bottom 0.305: v68.08,10.22 68.66,9.64 SEG1.1.P5
SEG5  (via drill 0.35)
  Top 0.305: IC6.1.6 42.13,7.84 43.94,9.65 55.96,9.65 v56.13,9.48
  Bottom 0.305: v56.13,9.48 58.5,7.11 SEG1.1.P1
SEG6  (via drill 0.35)
  Top 0.305: IC6.1.7 43.41,7.84 44.7,9.14 54.86,9.14 55.21,8.79 56.55,8.79 57.15,9.4 68.33,9.4 70.1,11.18 71.61,11.18 72.34,10.45 v78.74,10.45
  Bottom 0.305: v78.74,10.45 78.74,16.85 SEG1.1.P14
SEG7  (via drill 0.35)
  Top 0.305: IC6.1.8 44.67,7.59 45.72,8.64 54.73,8.64 55.02,8.34 56.73,8.34 57.34,8.94 68.52,8.94 69.99,10.41 v71.12,10.41
  Bottom 0.305: v71.12,10.41 71.12,16.85 SEG1.1.P17
SEG8  (via drill 0.35)
  Top 0.305: IC6.1.9 45.95,7.59 46.48,8.13 54.59,8.13 54.84,7.88 55.37,7.88 55.37,7.87 56.92,7.87 57.53,8.48 75.54,8.48 v76.2,9.14
  Bottom 0.305: v76.2,9.14 76.28,9.06 SEG1.1.P8
TM_CLK  (via drill 0.35)
  Top 0.305: IC1.1.10 29.72,12.84 29.72,12.19 29.97,11.94 30.99,11.94 31.24,11.68 35.56,11.68 v36.07,11.18
  Bottom 0.254: R5.5.1 48.29,10.19 47.5,9.4 42.16,9.4 41.66,9.91 R2.2.1
  Bottom 0.305: R2.2.1 39.59,10.75 39.17,11.18 v36.07,11.18
TM_DIO  (via drill 0.35)
  Top 0.305: IC1.1.9 31.38,12.45 35.81,12.45 v36.07,12.7
  Bottom 0.254: R5.6.1 45.99,10.75 R2.3.1 42.9,11.68 39.75,11.68 38.48,12.95
  Bottom 0.305: v36.07,12.7 36.32,12.95 38.48,12.95
TOUCH_KO
  cutout Bottom: 32.81,6.6 96.81,6.6 96.81,0 32.81,0
TOUCH_PWR  (via drill 0.35)
  Top 0.254: IC3.1.12 27.51,3.47 28.15,4.1 | IC3.1.6 v30.53,4.1 28.15,4.1 | IC3.1.11 28.15,4.1 | 28.7,7.35 29.2,6.86 v29.21,6.86
  Top 0.305: IC1.1.3 28.7,7.35
  Bottom 0.254: C1.4.1 29.21,4.76 | 29.21,4.76 29.87,4.76 v30.53,4.1 | v29.21,6.86 29.21,4.76
USB1  (via drill 0.35)
  Top 0.254: v19.81,13.97 v19.82,13.97 IC1.1.24
  Bottom 0.254: v19.81,13.97 18.8,14.99 16.22,14.99 15.84,14.6 15.36,14.6 14.22,13.46 14.22,12.45 13.72,11.94 11.99,11.94 10.48,13.45 8.59,13.45 X3.1.2 7.99,13.85 5.54,16.3 4.3,16.3 2.39,18.21 R5.9.1
USB2  (via drill 0.35)
  Top 0.254: IC1.1.12 30.33,15.71 v30.33,16.05 | v26.67,13.97 24.64,11.94 20.32,11.94 v19.05,13.21
  Bottom 0.152: 6.9,9.4 9.5,9.4
  Bottom 0.254: v30.33,16.05 28.25,13.97 v26.67,13.97 | v19.05,13.21 17.68,14.58 16.39,14.58 16.01,14.2 15.53,14.2 14.63,13.29 14.63,12.28 13.88,11.53 11.27,11.53 | 1.9,5.6 R5.8.1 1.9,5.5 4.2,7.8 5.3,7.8 6.9,9.4 | 11.27,11.53 10.9,11.9 10.1,11.9 9.05,10.85 X3.1.3 | 11.27,11.53 11.1,11.36 11.1,11 9.5,9.4
USB_IN_SW
  Top 0.203: IC1.1.20 23.15,15.37 20.6,17.92 20.6,19 19.46,20.14 IC7.1.4
VBUS  (via drill 0.35)
  Top 0.254: D1.1.3 12.19,11.68
  Top 0.61: v10.41,11.29 10.81,11.68 12.19,11.68 13.29,11.68 Q1.1.4
  Bottom 0.152: 9.21,10.09 8.93,9.8 7.3,9.8
  Bottom 0.254: X2.1.1 6.35,10.55
  Bottom 0.305: 6.35,10.55 6.55,10.55 7.3,9.8 | 9.01,9.89 9.21,10.09 v10.41,11.29

### Text on the board
tDocu: 1 | 1
tPrint: interval | [h] | duration | [m] | counter | [h] | attiny84 | TM1637 | TTP224
bPrint: MI | +5 | CK | MO | RESET | RS | GD | Version 1.4.3 | Phil Malessa | 23.02.2021 | made by